# EAGLE design nano_to_DIP (EAGLE 6.4)
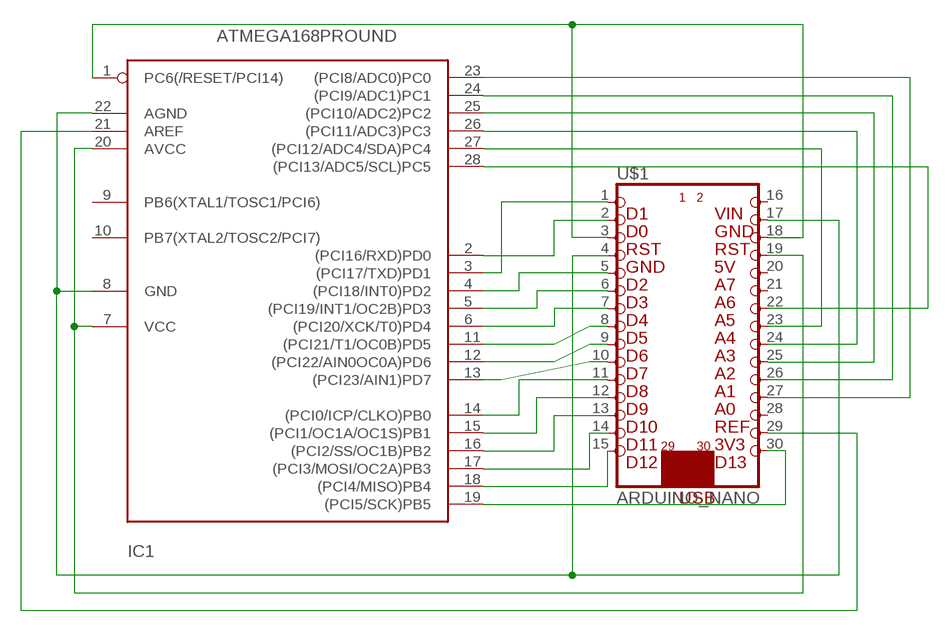
[diagram p0: schematic, sheet 1]

## Parts
IC1  ATMEGA168PROUND  [DIL28-3-ROUND]
U$1  ARDUINO_NANO  [NANOPIN]

## Nets
N$1: IC1.3((PCI17/TXD)PD1) U$1.1
N$2: IC1.2((PCI16/RXD)PD0) U$1.2
N$3: IC1.1(PC6(/RESET/PCI14)) U$1.3 U$1.18
N$4: IC1.19((PCI5/SCK)PB5) U$1.30
N$5: IC1.7(VCC) IC1.20(AVCC) U$1.19
N$6: IC1.8(GND) IC1.22(AGND) U$1.4 U$1.17
N$7: IC1.18((PCI4/MISO)PB4) U$1.15
N$8: IC1.4((PCI18/INT0)PD2) U$1.5
N$9: IC1.5((PCI19/INT1/OC2B)PD3) U$1.6
N$10: IC1.17((PCI3/MOSI/OC2A)PB3) U$1.14
N$11: IC1.16((PCI2/SS/OC1B)PB2) U$1.13
N$12: IC1.23((PCI8/ADC0)PC0) U$1.27
N$13: IC1.24((PCI9/ADC1)PC1) U$1.26
N$14: IC1.25((PCI10/ADC2)PC2) U$1.25
N$15: IC1.26((PCI11/ADC3)PC3) U$1.24
N$16: IC1.27((PCI12/ADC4/SDA)PC4) U$1.23
N$17: IC1.28((PCI13/ADC5/SCL)PC5) U$1.22
N$18: IC1.6((PCI20/XCK/T0)PD4) U$1.7
N$19: IC1.11((PCI21/T1/OC0B)PD5) U$1.8
N$20: IC1.12((PCI22/AIN0OC0A)PD6) U$1.9
N$21: IC1.14((PCI0/ICP/CLKO)PB0) U$1.11
N$22: IC1.15((PCI1/OC1A/OC1S)PB1) U$1.12
N$23: IC1.13((PCI23/AIN1)PD7) U$1.10
N$24: IC1.21(AREF) U$1.29
Unconnected: IC1.9(PB6(XTAL1/TOSC1/PCI6)) IC1.10(PB7(XTAL2/TOSC2/PCI7)) U$1.16 U$1.20 U$1.21 U$1.28

## Library data of the parts
IC1 = adafruit:ATMEGA168*P: MICROCONTROLLER 16 kBytes FLASH 1 kBytes SRAM 512 Bytes EEPROM USART 8-channel 10 bit ADC
U$1 = dedicatedLib:ARDUINO_NANO

## Board
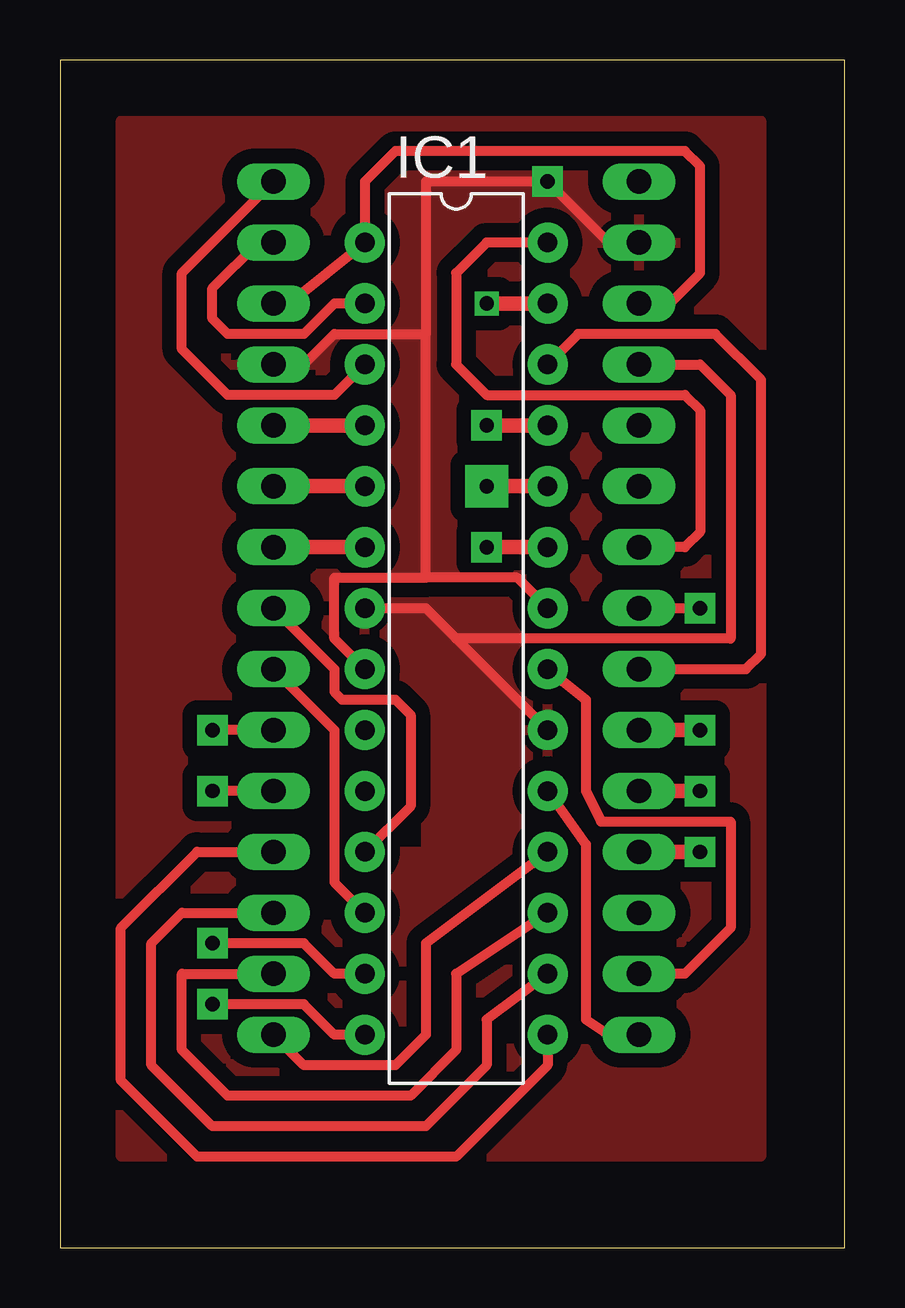
[diagram p1: board, top side]
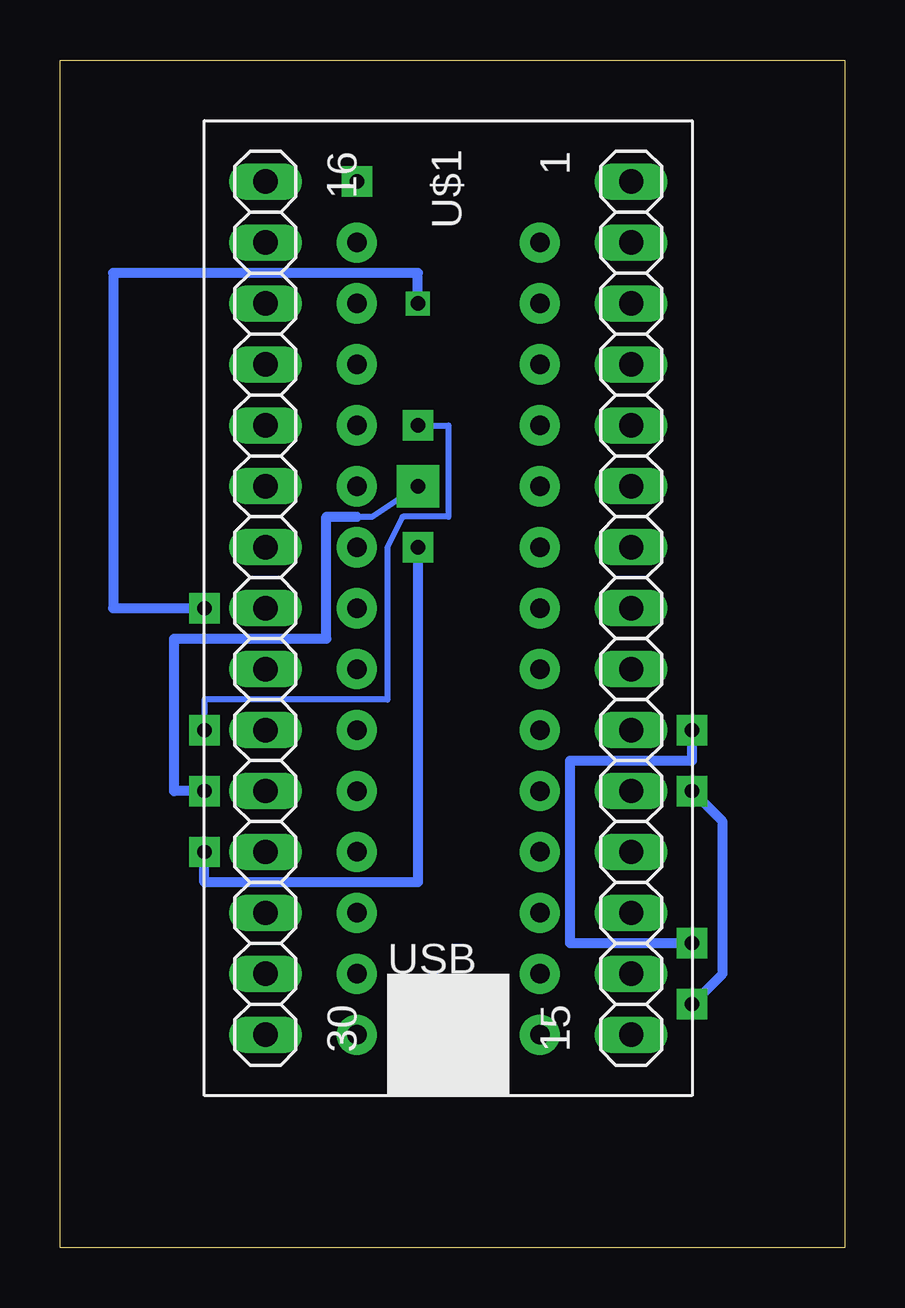
[diagram p2: board, bottom side, seen from below]

Size 32.69 x 49.52 mm. Coordinates in mm from the lower left corner, seen from the top.
Outline: 0,0 32.69,0 32.69,49.52 0,49.52 0,0
Copper layers (1*16): Top 0.035mm / dielectric 1.5mm / Bottom 0.035mm
Design rules "default": minimum track width 10mil, minimum drill 24mil, track to track 8mil, track to pad 8mil, pad to pad 8mil, via to via 8mil, smd to smd 8mil, copper to edge 40mil, drill to drill 8mil, minimum pad ring 10mil, minimum via ring 8mil, stop-mask expansion 4mil, vias tented up to drill 0mil, thermal gap 10mil

### Footprints (pad centres in the part's own frame; a part is rotated, then mirrored left to right if it is on the bottom)
DIL28-3-ROUND = drill 0.813 pad 1.676: 1 -16.51,-3.81; 2 -13.97,-3.81; 3 -11.43,-3.81; 4 -8.89,-3.81; 5 -6.35,-3.81; 6 -3.81,-3.81; 7 -1.27,-3.81; 8 1.27,-3.81; 9 3.81,-3.81; 10 6.35,-3.81; 11 8.89,-3.81; 12 11.43,-3.81; 13 13.97,-3.81; 14 16.51,-3.81; 15 16.51,3.81; 16 13.97,3.81; 17 11.43,3.81; 18 8.89,3.81; 19 6.35,3.81; 20 3.81,3.81; 21 1.27,3.81; 22 -1.27,3.81; 23 -3.81,3.81; 24 -6.35,3.81; 25 -8.89,3.81; 26 -11.43,3.81; 27 -13.97,3.81; 28 -16.51,3.81
NANOPIN = drill 1.016 long: 1 -17.78,7.62; 2 -15.24,7.62; 3 -12.7,7.62; 4 -10.16,7.62; 5 -7.62,7.62; 6 -5.08,7.62; 7 -2.54,7.62; 8 0,7.62; 9 2.54,7.62; 10 5.08,7.62; 11 7.62,7.62; 12 10.16,7.62; 13 12.7,7.62; 14 15.24,7.62; 15 17.78,7.62; 16 -17.78,-7.62; 17 -15.24,-7.62; 18 -12.7,-7.62; 19 -10.16,-7.62; 20 -7.62,-7.62; 21 -5.08,-7.62; 22 -2.54,-7.62; 23 0,-7.62; 24 2.54,-7.62; 25 5.08,-7.62; 26 7.62,-7.62; 27 10.16,-7.62; 28 12.7,-7.62; 29 15.24,-7.62; 30 17.78,-7.62

### Placement (x,y rotation side)
IC1  16.51,25.4 270 top
U$1  16.51,26.67 270 bottom

### Tracks (layer width: path | path; a pad name or v marks a point on that pad's centre or on a via)
N$1
  Top 0.406: IC1.3 11.43,35.56 6.99,35.56 5.08,37.46 5.08,40.64 U$1.1
N$2
  Top 0.406: IC1.2 11.43,39.37 10.16,38.1 6.99,38.1 6.35,38.73 6.35,40.01 8.25,41.91 U$1.2
N$3
  Top 0.406: U$1.3 9.53,39.37 IC1.1 12.7,44.45 13.97,45.72 26.04,45.72 26.67,45.09 26.67,40.64 25.4,39.37 U$1.18
N$4
  Top 0.406: IC1.19 21.91,16.83 21.91,9.53 22.86,8.89 U$1.30
N$5
  Top 0.406: IC1.7 15.24,26.67 16.51,25.4 | 16.51,25.4 IC1.20 | U$1.19 26.67,36.83 27.94,35.56 27.94,25.4 16.51,25.4
  pour Top (isolate 0.61): 11.43,27.94 11.43,22.86 15.24,22.86 15.24,16.51 12.7,16.51 12.7,8.89 12.7,7.62 13.34,8.25 15.24,8.25 15.24,12.7 15.88,12.7 20.32,17.14 20.32,26.67 19.05,27.94 12.07,27.94
N$6  (via drill 0.6, 0.6 pad 1.27)
  Top 0.406: U$1.4 10.16,36.83 11.43,38.1 15.24,38.1 | IC1.8 11.43,25.4 11.43,27.94 15.24,27.94 | 15.24,27.94 15.24,38.1 | IC1.22 19.05,27.94 15.24,27.94 | U$1.17 22.86,41.91 v20.32,44.45 15.24,44.45 15.24,38.1
  pour Top (isolate 0.61): 2.54,46.99 30.48,46.99 30.48,27.94 11.43,27.94 11.43,16.51 2.54,16.51
N$7
  Top 0.406: IC1.18 15.24,12.7 15.24,8.89 13.97,7.62 10.16,7.62 U$1.15
N$8
  Top 0.61: IC1.4 U$1.5
N$9
  Top 0.61: IC1.5 U$1.6
N$10
  Top 0.406: IC1.17 16.51,11.43 16.51,8.25 14.61,6.35 6.99,6.35 5.08,8.25 5.08,11.43 U$1.14
N$11
  Top 0.406: IC1.16 17.78,9.53 17.78,7.62 15.24,5.08 6.35,5.08 3.81,7.62 3.81,12.7 5.08,13.97 U$1.13
N$12  (via drill 0.6, 0.6 pad 1.27)
  Top 0.61: IC1.23 v17.78,29.21 | U$1.27 v26.67,16.51
  Bottom 0.406: v17.78,29.21 17.78,15.24 26.67,15.24 v26.67,16.51
N$13  (via drill 0.6, 0.6 pad 1.27, 0.6 pad 1.78)
  Top 0.61: IC1.24 v17.78,31.75 | v26.67,19.05 U$1.26
  Bottom 0.254: 20.32,30.48 19.68,30.48 v17.78,31.75
  Bottom 0.406: v26.67,19.05 27.94,19.05 27.94,25.4 21.59,25.4 21.59,30.48 20.32,30.48
N$14  (via drill 0.6, 0.6 pad 1.27)
  Top 0.61: IC1.25 v17.78,34.29 | U$1.25 v26.67,21.59
  Bottom 0.254: v26.67,21.59 26.67,22.86 19.05,22.86 19.05,29.21 18.41,30.48 16.51,30.48 16.51,34.29 v17.78,34.29
N$15
  Top 0.406: U$1.24 28.57,24.13 29.21,24.77 29.21,36.2 27.3,38.1 21.59,38.1 IC1.26
N$16  (via drill 0.6, 0.6 pad 1.27)
  Top 0.406: U$1.23 v26.67,26.67
  Top 0.61: IC1.27 v17.78,39.37
  Bottom 0.406: v17.78,39.37 17.78,40.64 30.48,40.64 30.48,26.67 v26.67,26.67
N$17
  Top 0.406: IC1.28 17.78,41.91 16.51,40.64 16.51,36.83 17.78,35.56 26.04,35.56 26.67,34.92 26.67,29.84 26.04,29.21 U$1.22
N$18
  Top 0.61: IC1.6 U$1.7
N$19
  Top 0.406: U$1.8 11.43,24.13 11.43,23.18 11.75,22.86 13.97,22.86 14.61,22.22 14.61,18.41 IC1.11
N$20
  Top 0.406: U$1.9 11.43,21.59 11.43,15.24 IC1.12
N$21  (via drill 0.6, 0.6 pad 1.27)
  Top 0.406: U$1.11 v6.35,19.05 | IC1.14 11.43,8.89 10.16,10.16 v6.35,10.16
  Bottom 0.406: v6.35,10.16 5.08,11.43 5.08,17.78 v6.35,19.05
N$22
  Top 0.406: IC1.15 20.32,7.62 16.51,3.81 5.71,3.81 2.54,6.99 2.54,13.34 5.71,16.51 U$1.12
N$23  (via drill 0.6, 0.6 pad 1.27)
  Top 0.406: IC1.13 11.43,11.43 10.16,12.7 v6.35,12.7 | U$1.10 v6.35,21.59
  Bottom 0.406: v6.35,12.7 11.43,12.7 11.43,20.32 6.35,20.32 v6.35,21.59
N$24
  Top 0.406: IC1.21 21.91,22.86 21.91,19.05 22.54,17.78 27.94,17.78 27.94,13.34 26.04,11.43 U$1.29
N@1
  pour Top (isolate 0.61): 2.54,46.99 29.21,46.99 29.21,3.81 16.51,3.81 20.32,35.56 16.51,35.56 16.51,38.1 5.08,38.1 9.53,34.92 8.89,34.29 15.88,3.81 2.54,3.81